# Altium schematic sheet IEA_uRobots_v2.SchDoc: IEA_uRobot v2 (part 1 of 2)
size 533 x 419 mm; Engineer: Paulo Loma Marconi
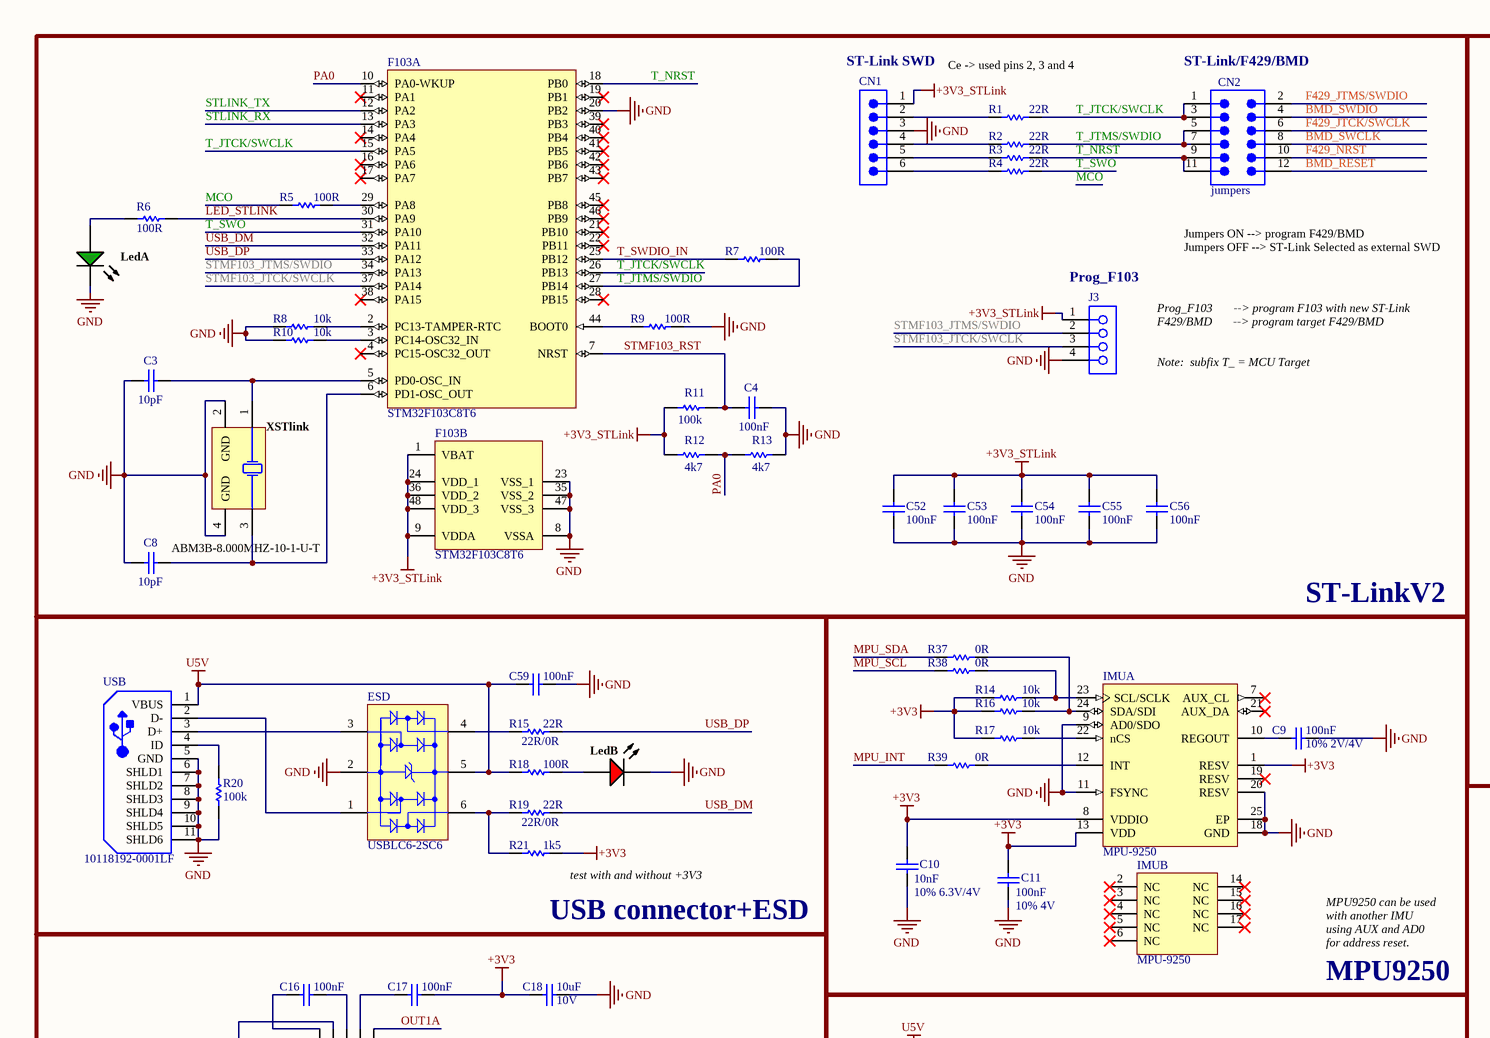
[diagram p0: IEA_uRobots_v2.SchDoc, top left]
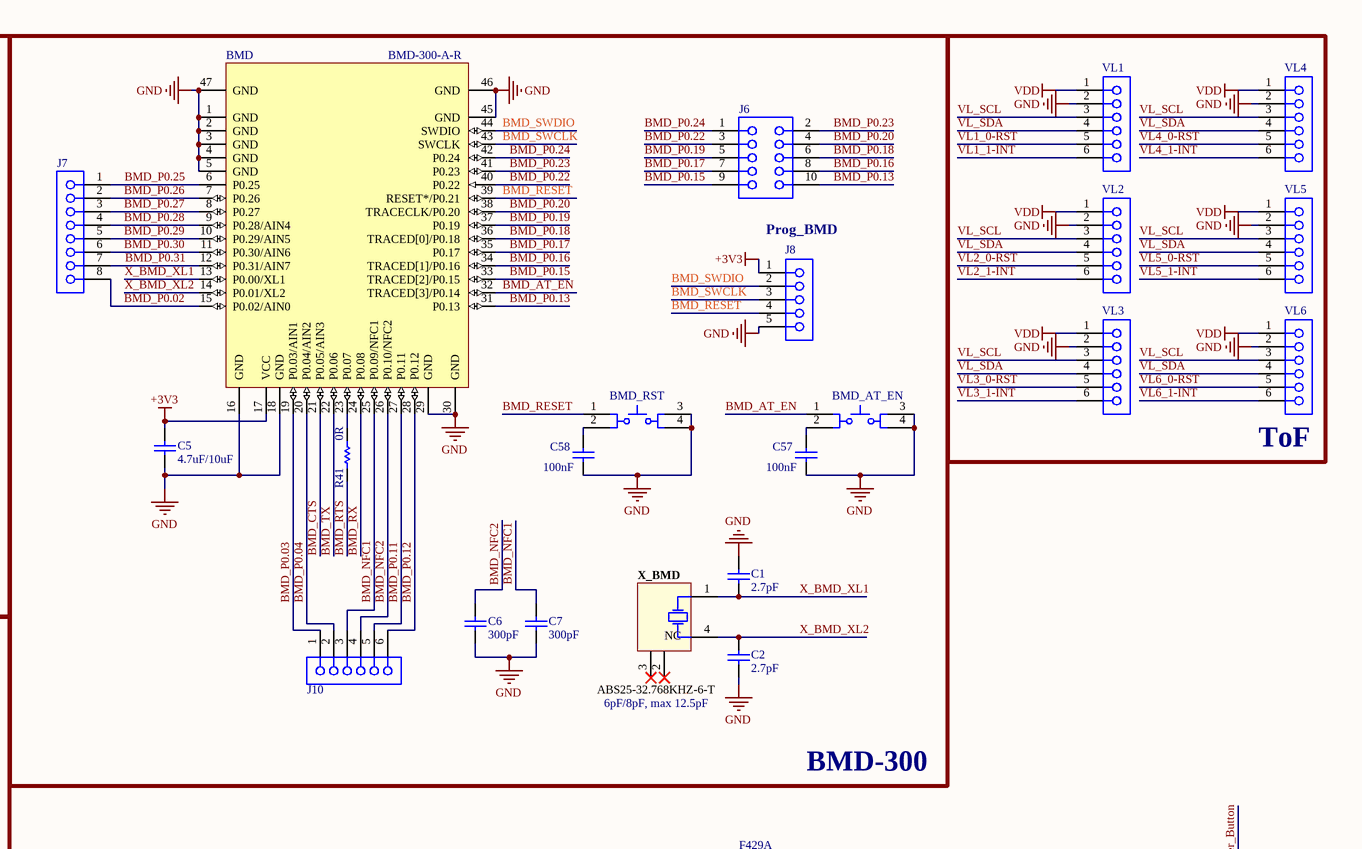
[diagram p1: IEA_uRobots_v2.SchDoc, top right]
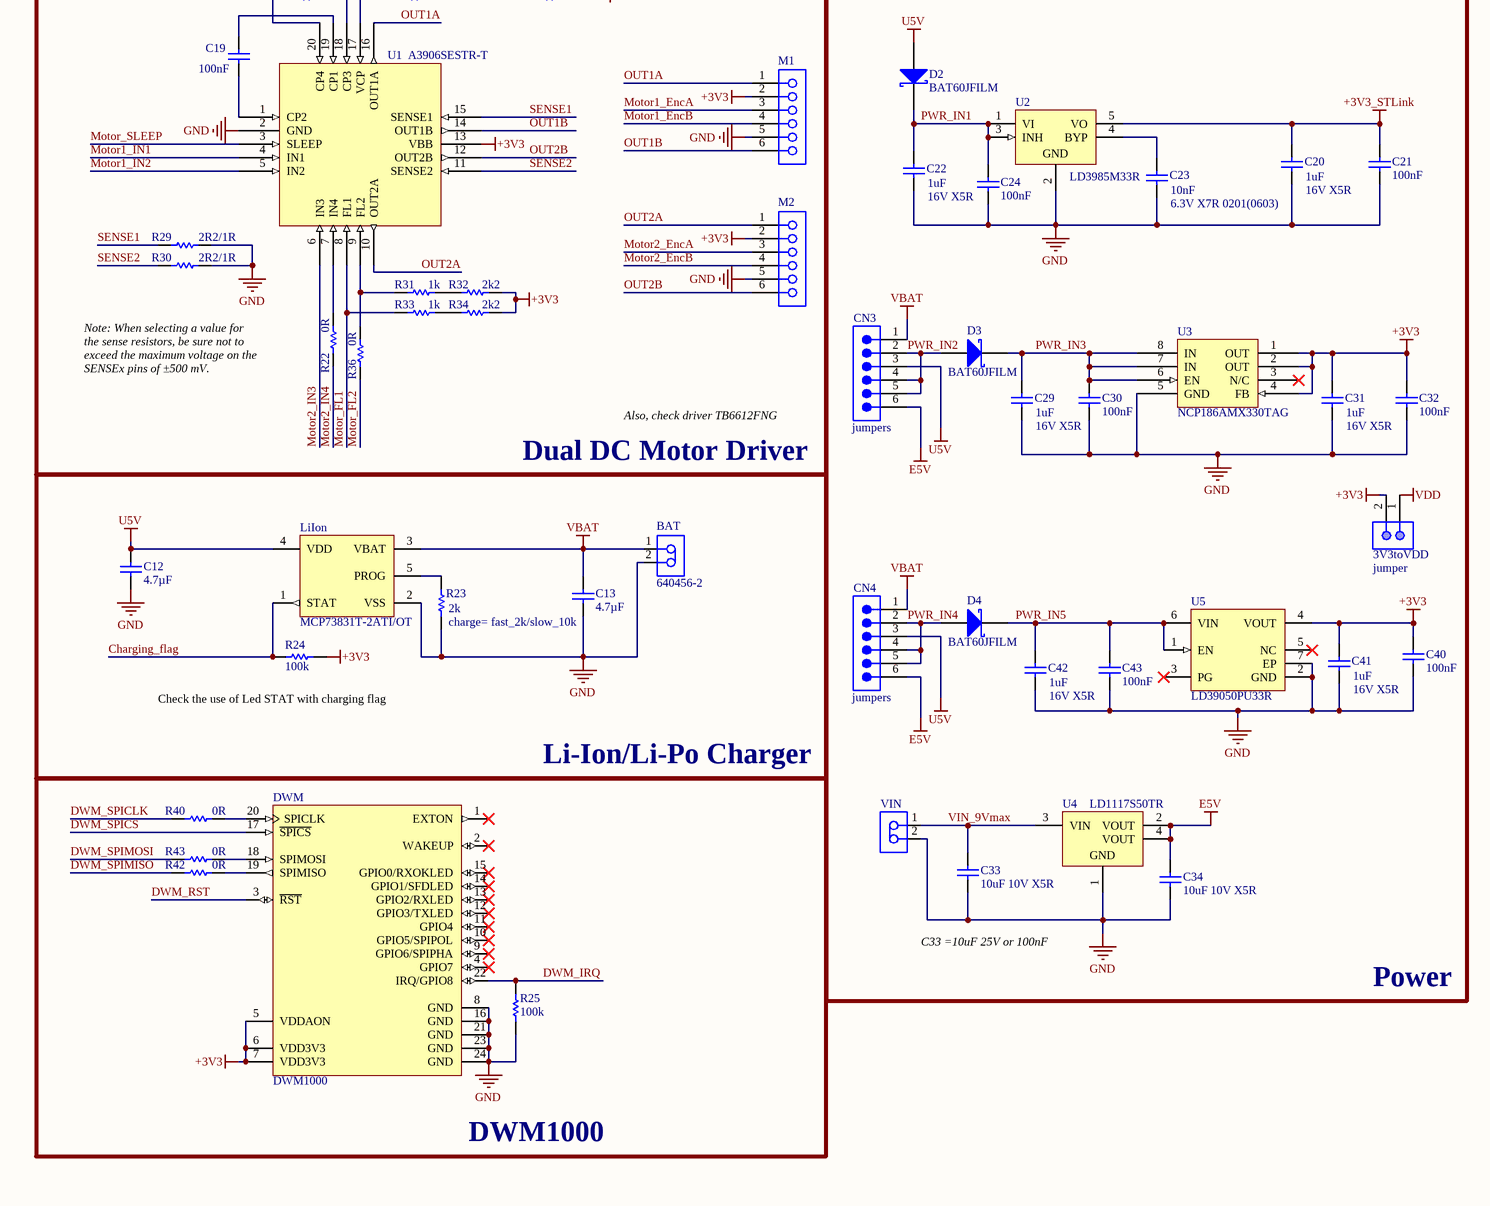
[diagram p2: IEA_uRobots_v2.SchDoc, bottom left]
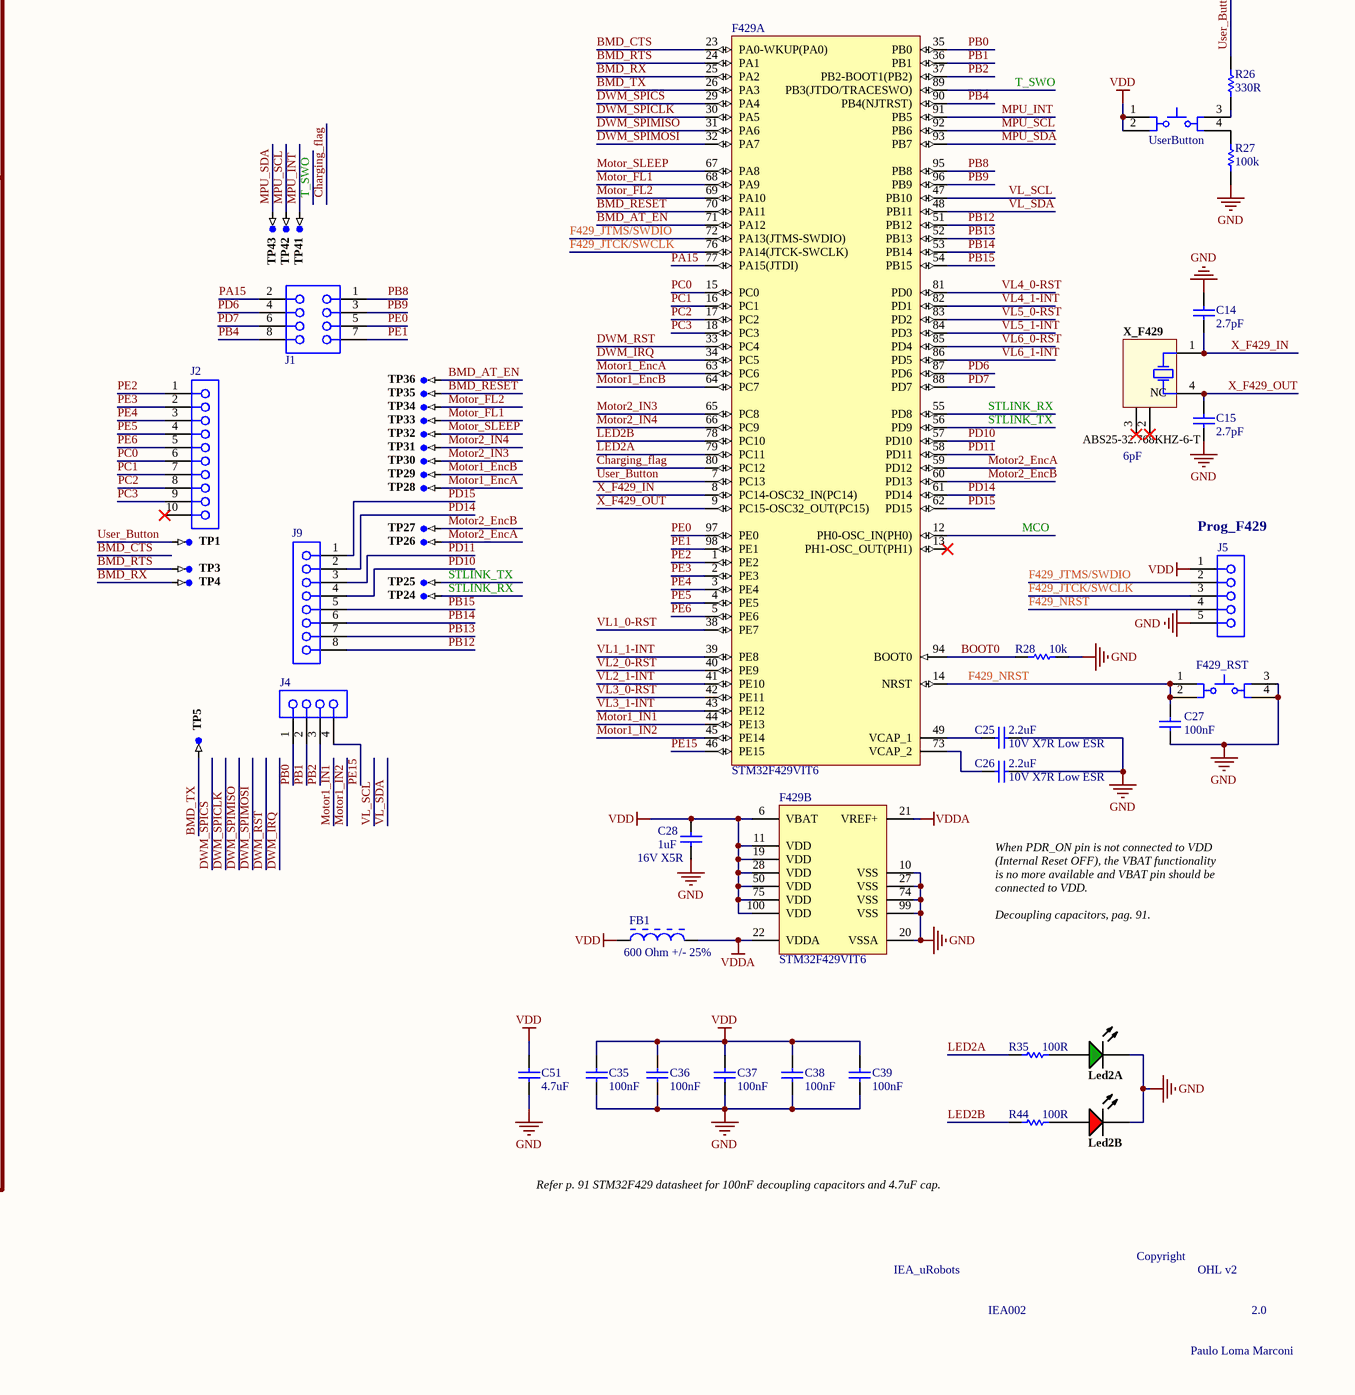
[diagram p3: IEA_uRobots_v2.SchDoc, bottom right]

## Parts
(Parts that share a designator on the sheet are numbered #1, #2 ... from top to bottom, then left to right.)
3V3toVDD  jumper  [WE-61300211121_V]
BAT  640456-2  [TECO-640456-2_V]
BMD  Manufacturer P/N: BMD-300-A-R  [BMD-300]  (hidden comment: BMD-300)
BMD_AT_EN  PTS645SM43SMTR92 LFS  [CKCP-PTS645S_V]  (value not drawn)
BMD_RST  PTS645SM43SMTR92 LFS  [CKCP-PTS645S_V]  (value not drawn)
C1  value 2.7pF  [CAPC0402(1005)60_N]  (hidden comment: CAP 2.7pF 16V 0402(1005))
C2  value 2.7pF  [CAPC0402(1005)60_N]  (hidden comment: CAP 2.7pF 16V 0402(1005))
C3  value 10pF  [CAPC0805(2012)100_L]  (hidden comment: CAP 10pF 16V 0805(2012))
C4  value 100nF  [CAPC0805(2012)100_M]  (hidden comment: CAP 100nF 50V 0805(2012))
C5  value 4.7uF/10uF  [CAPC2013X135X45ML10T25]  (hidden comment: GRM21BR61E475MA12L)
C6  value 300pF  [CAPC0805(2012)100_M]  (hidden comment: CAP 300pF 50V 0805(2012))
C7  value 300pF  [CAPC0805(2012)100_M]  (hidden comment: CAP 300pF 50V 0805(2012))
C8  value 10pF  [CAPC0805(2012)100_L]  (hidden comment: CAP 10pF 16V 0805(2012))
C9  10% 2V/4V  value 100nF  [CAPC0201(0603)33_M]
C10  10% 6.3V/4V  value 10nF  [CAPC0201(0603)33_L]
C11  10% 4V  value 100nF  [CAPC0201(0603)33_M]
C12  Capacitance: 4.7µF  [CAPC2013X145X20LL20]  (hidden comment: C2012X7R1E475K125AB)
C13  Capacitance: 4.7µF  [CAPC2013X145X20LL20]  (hidden comment: C2012X7R1E475K125AB)
C14  value 2.7pF  [CAPC0402(1005)60_N]  (hidden comment: CAP 2.7pF 16V 0402(1005))
C15  value 2.7pF  [CAPC0402(1005)60_N]  (hidden comment: CAP 2.7pF 16V 0402(1005))
C16  value 100nF  [CAPC0805(2012)100_M]  (hidden comment: CAP 100nF 50V 0805(2012))
C17  value 100nF  [CAPC0805(2012)100_M]  (hidden comment: CAP 100nF 50V 0805(2012))
C18  10V  Capacitance: 10uF  [CAPC2013X145X50LL20T20]
C19  value 100nF  [CAPC0805(2012)100_M]  (hidden comment: CAP 100nF 50V 0805(2012))
C20  16V X5R  value 1uF  [CAPC0805(2012)100_N]
C21  value 100nF  [CAPC0805(2012)100_M]  (hidden comment: CAP 100nF 50V 0805(2012))
C22  16V X5R  value 1uF  [CAPC0805(2012)100_N]
C23  6.3V X7R 0201(0603)  value 10nF  [CAPC0201(0603)33_L]
C24  value 100nF  [CAPC0805(2012)100_M]  (hidden comment: CAP 100nF 50V 0805(2012))
C25  10V X7R Low ESR  value 2.2uF  [CAPC0805(2012)145_N]
C26  10V X7R Low ESR  value 2.2uF  [CAPC0805(2012)145_N]
C27  value 100nF  [CAPC0805(2012)100_M]  (hidden comment: CAP 100nF 50V 0805(2012))
C28  16V X5R  value 1uF  [CAPC0805(2012)100_N]
C29  16V X5R  value 1uF  [CAPC0805(2012)100_N]
C30  value 100nF  [CAPC0805(2012)100_M]  (hidden comment: CAP 100nF 50V 0805(2012))
C31  16V X5R  value 1uF  [CAPC0805(2012)100_N]
C32  value 100nF  [CAPC0805(2012)100_M]  (hidden comment: CAP 100nF 50V 0805(2012))
C33  10uF 10V X5R  [CAPC2013X145X50LL20T20]
C34  10uF 10V X5R  [CAPC2013X145X50LL20T20]
C35  value 100nF  [CAPC0805(2012)100_M]  (hidden comment: CAP 100nF 50V 0805(2012))
C36  value 100nF  [CAPC0805(2012)100_M]  (hidden comment: CAP 100nF 50V 0805(2012))
C37  value 100nF  [CAPC0805(2012)100_M]  (hidden comment: CAP 100nF 50V 0805(2012))
C38  value 100nF  [CAPC0805(2012)100_M]  (hidden comment: CAP 100nF 50V 0805(2012))
C39  value 100nF  [CAPC0805(2012)100_M]  (hidden comment: CAP 100nF 50V 0805(2012))
C40  value 100nF  [CAPC0805(2012)100_M]  (hidden comment: CAP 100nF 50V 0805(2012))
C41  16V X5R  value 1uF  [CAPC0805(2012)100_N]
C42  16V X5R  value 1uF  [CAPC0805(2012)100_N]
C43  value 100nF  [CAPC0805(2012)100_M]  (hidden comment: CAP 100nF 50V 0805(2012))
C51  value 4.7uF  [CAPC2013X135X45ML10T25]  (hidden comment: GRM21BR61E475MA12L)
C52  value 100nF  [CAPC0805(2012)100_M]  (hidden comment: CAP 100nF 50V 0805(2012))
C53  value 100nF  [CAPC0805(2012)100_M]  (hidden comment: CAP 100nF 50V 0805(2012))
C54  value 100nF  [CAPC0805(2012)100_M]  (hidden comment: CAP 100nF 50V 0805(2012))
C55  value 100nF  [CAPC0805(2012)100_M]  (hidden comment: CAP 100nF 50V 0805(2012))
C56  value 100nF  [CAPC0805(2012)100_M]  (hidden comment: CAP 100nF 50V 0805(2012))
C57  value 100nF  [CAPC0805(2012)100_M]  (hidden comment: CAP 100nF 50V 0805(2012))
C58  value 100nF  [CAPC0805(2012)100_M]  (hidden comment: CAP 100nF 50V 0805(2012))
C59  value 100nF  [CAPC0805(2012)100_M]  (hidden comment: CAP 100nF 50V 0805(2012))
CN1  MTLW-106-05-X-S-210  [SMTC-MTLW-106-05-X-S-210]  (value not drawn)
CN2  jumpers  [SMTC-TSW-106-07-X-D]
CN3  jumpers  [SMTC-MTLW-106-05-X-S-210]
CN4  jumpers  [SMTC-MTLW-106-05-X-S-210]
D2  BAT60JFILM  [STM-SOD-323-2_V]
D3  BAT60JFILM  [STM-SOD-323-2_V]
D4  BAT60JFILM  [STM-SOD-323-2_V]
DWM  DWM1000  [DECW-DWM1000-24_V]
ESD  USBLC6-2SC6  [STM-SOT23-6L_V]
F103  STM32F103C8T6  [STM-LQFP48_L]  (parts A,B of 2)
F429  STM32F429VIT6  [STM-LQFP100_N]  (parts A,B of 2)
F429_RST  PTS645SM43SMTR92 LFS  [CKCP-PTS645S_V]  (value not drawn)
FB1  Impedance (at 100 MHz): 600 Ohm +/- 25%  [MURA-BLM21-H1-CHIP-2_V]  (hidden comment: BLM21AG601SN1D)
IMU#1  MPU-9250  [INSE-QFN-24-1700X1540TP_M]  (part A of 2)
IMU#2  MPU-9250  [INSE-QFN-24-1700X1540TP_M]  (part B of 2)
J1  SSW-104-02-T-D  [SMTC-SSW-104-02-X-D]  (value not drawn)
J2  SSW-110-01-G-S  [SMTC-SSW-110-01-G-S]  (value not drawn)
J3  SLW-104-01-G-S  [SMTC-SLW-104-01-X-S]  (value not drawn)
J4  SLW-104-01-G-S  [SMTC-SLW-104-01-X-S]  (value not drawn)
J5  SSW-105-01-G-S  [SMTC-SSW-105-01-X-S]  (value not drawn)
J6  BCS-105-F-D-TE  [SMTC-BCS-105-X-D-TE]  (value not drawn)
J7  SSW-108-01-G-S  [SMTC-SSW-108-01-G-S]  (value not drawn)
J8  SSW-105-01-G-S  [SMTC-SSW-105-01-X-S]  (value not drawn)
J9  SSQ-108-01-L-S  [SMTC-SSQ-108-01-X-S]  (value not drawn)
J10  SSW-106-02-G-S  [SMTC-SSW-106-02-X-S]  (value not drawn)
Led  HSMF-C155  [AVAG-HSMF-C15X_V]  (value not drawn)  (parts A,B of 2)
Led2  HSMF-C155  [AVAG-HSMF-C15X_V]  (value not drawn)  (parts A,B of 2)
LiIon  MCP73831T-2ATI/OT  [SOT-23-OT5_M]
M1  SSW-106-02-G-S  [SMTC-SSW-106-02-X-S]  (value not drawn)
M2  SSW-106-02-G-S  [SMTC-SSW-106-02-X-S]  (value not drawn)
R1  value 22R  [RESC0805(2012)_L]  (hidden comment: 22R 1% 0805(2012))
R2  value 22R  [RESC0805(2012)_L]  (hidden comment: 22R 1% 0805(2012))
R3  value 22R  [RESC0805(2012)_L]  (hidden comment: 22R 1% 0805(2012))
R4  value 22R  [RESC0805(2012)_L]  (hidden comment: 22R 1% 0805(2012))
R5  value 100R  [RESC0805(2012)_L]  (hidden comment: 100R 1% 0805(2012))
R6  value 100R  [RESC0805(2012)_L]  (hidden comment: 100R 1% 0805(2012))
R7  value 100R  [RESC0805(2012)_L]  (hidden comment: 100R 1% 0805(2012))
R8  value 10k  [RESC0805(2012)_M]  (hidden comment: 10K 1% 0805(2012))
R9  value 100R  [RESC0805(2012)_L]  (hidden comment: 100R 1% 0805(2012))
R10  value 10k  [RESC0805(2012)_M]  (hidden comment: 10K 1% 0805(2012))
R11  value 100k  [RESC0805(2012)_L]  (hidden comment: 100K 1% 0805(2012))
R12  value 4k7  [RESC0805(2012)_M]  (hidden comment: 4K7 1% 0805(2012))
R13  value 4k7  [RESC0805(2012)_M]  (hidden comment: 4K7 1% 0805(2012))
R14  value 10k  [RESC0805(2012)_M]  (hidden comment: 10K 1% 0805(2012))
R15  22R/0R  value 22R  [RESC0805(2012)_L]
R16  value 10k  [RESC0805(2012)_M]  (hidden comment: 10K 1% 0805(2012))
R17  value 10k  [RESC0805(2012)_M]  (hidden comment: 10K 1% 0805(2012))
R18  value 100R  [RESC0805(2012)_L]  (hidden comment: 100R 1% 0805(2012))
R19  22R/0R  value 22R  [RESC0805(2012)_L]
R20  value 100k  [RESC0805(2012)_L]  (hidden comment: 100K 1% 0805(2012))
R21  value 1k5  [RESC0805(2012)_M]  (hidden comment: 1K5 1% 0805(2012))
R22  0R  [RESC0805(2012)_N]
R23  charge= fast_2k/slow_10k  value 2k  [RESC0805(2012)_L]
R24  value 100k  [RESC0805(2012)_L]  (hidden comment: 100K 1% 0805(2012))
R25  value 100k  [RESC0805(2012)_L]  (hidden comment: 100K 1% 0805(2012))
R26  value 330R  [RESC0805(2012)_M]  (hidden comment: 330R 1% 0805(2012))
R27  value 100k  [RESC0805(2012)_L]  (hidden comment: 100K 1% 0805(2012))
R28  value 10k  [RESC0805(2012)_M]  (hidden comment: 10K 1% 0805(2012))
R29  value 2R2/1R  [RESC0805(2012)_M]  (hidden comment: 1R 1% 0805(2012))
R30  value 2R2/1R  [RESC0805(2012)_M]  (hidden comment: 1R 1% 0805(2012))
R31  value 1k  [RESC0805(2012)_M]  (hidden comment: 1K 1% 0805(2012))
R32  value 2k2  [RESC0805(2012)_N]  (hidden comment: 2K2 1% 0805(2012))
R33  value 1k  [RESC0805(2012)_M]  (hidden comment: 1K 1% 0805(2012))
R34  value 2k2  [RESC0805(2012)_N]  (hidden comment: 2K2 1% 0805(2012))
R35  value 100R  [RESC0805(2012)_L]  (hidden comment: 100R 1% 0805(2012))
R36  0R  [RESC0805(2012)_N]
R37  0R  [RESC0805(2012)_N]
R38  0R  [RESC0805(2012)_N]
R39  0R  [RESC0805(2012)_N]
R40  0R  [RESC0805(2012)_N]
R41  0R  [RESC0805(2012)_N]
R42  0R  [RESC0805(2012)_N]
R43  0R  [RESC0805(2012)_N]
R44  value 100R  [RESC0805(2012)_L]  (hidden comment: 100R 1% 0805(2012))
TP1  TP-SM-C-100  [TP-SM-C-100]  (value not drawn)  (no BOM)
TP3  TP-SM-C-100  [TP-SM-C-100]  (value not drawn)  (no BOM)
TP4  TP-SM-C-100  [TP-SM-C-100]  (value not drawn)  (no BOM)
TP5  TP-SM-C-100  [TP-SM-C-100]  (value not drawn)  (no BOM)
TP24  TP-SM-C-100  [TP-SM-C-100]  (value not drawn)  (no BOM)
TP25  TP-SM-C-100  [TP-SM-C-100]  (value not drawn)  (no BOM)
TP26  TP-SM-C-100  [TP-SM-C-100]  (value not drawn)  (no BOM)
TP27  TP-SM-C-100  [TP-SM-C-100]  (value not drawn)  (no BOM)
TP28  TP-SM-C-100  [TP-SM-C-100]  (value not drawn)  (no BOM)
TP29  TP-SM-C-100  [TP-SM-C-100]  (value not drawn)  (no BOM)
TP30  TP-SM-C-100  [TP-SM-C-100]  (value not drawn)  (no BOM)
TP31  TP-SM-C-100  [TP-SM-C-100]  (value not drawn)  (no BOM)
TP32  TP-SM-C-100  [TP-SM-C-100]  (value not drawn)  (no BOM)
TP33  TP-SM-C-100  [TP-SM-C-100]  (value not drawn)  (no BOM)
TP34  TP-SM-C-100  [TP-SM-C-100]  (value not drawn)  (no BOM)
TP35  TP-SM-C-100  [TP-SM-C-100]  (value not drawn)  (no BOM)
TP36  TP-SM-C-100  [TP-SM-C-100]  (value not drawn)  (no BOM)
TP41  TP-SM-C-100  [TP-SM-C-100]  (value not drawn)  (no BOM)
TP42  TP-SM-C-100  [TP-SM-C-100]  (value not drawn)  (no BOM)
TP43  TP-SM-C-100  [TP-SM-C-100]  (value not drawn)  (no BOM)
U1  A3906SESTR-T  [A3906SESTR-T]
U2  LD3985M33R  [SOT23-5L_N]
U3  NCP186AMX330TAG  [NCP186AMX330TAG]
U4  LD1117S50TR  [SOT-223_L]
U5  LD39050PU33R  [DFN6D_L]
USB  10118192-0001LF  [FCI-10118192-0001LF-5_V]
UserButton  PTS645SM43SMTR92 LFS  [CKCP-PTS645S_V]  (value not drawn)
VIN  640456-2  [TECO-640456-2_V]  (value not drawn)
VL1  SSW-106-02-G-S  [SMTC-SSW-106-02-X-S]  (value not drawn)
VL2  SSW-106-02-G-S  [SMTC-SSW-106-02-X-S]  (value not drawn)
VL3  SSW-106-02-G-S  [SMTC-SSW-106-02-X-S]  (value not drawn)
VL4  SSW-106-02-G-S  [SMTC-SSW-106-02-X-S]  (value not drawn)
VL5  SSW-106-02-G-S  [SMTC-SSW-106-02-X-S]  (value not drawn)
VL6  SSW-106-02-G-S  [SMTC-SSW-106-02-X-S]  (value not drawn)
X_BMD  ABS25-32.768KHZ-6-T  Load Capacitance: 6pF/8pF, max 12.5pF  [ABRA-ABS25-4_V]
X_F429  ABS25-32.768KHZ-6-T  Load Capacitance: 6pF  [ABRA-ABS25-4_V]
XSTlink  ABM3B-8.000MHZ-10-1-U-T  [ABRA-ABM3B_V]

## Blocks framed on the sheet
ST-LinkV2: C3 C4 C8 C52-C56 CN1 CN2 F103 J3 Led R1-R13 XSTlink
BMD-300: BMD BMD_AT_EN BMD_RST C1 C2 C5-C7 C57 C58 J6-J8 J10 R41 X_BMD
ToF: VL1-VL6
USB connector+ESD: C59 ESD Led R15 R18-R21 USB
Dual DC Motor Driver: C16-C19 M1 M2 R22 R29-R34 R36 U1

## Nets
+3V3: 3V3toVDD.2 BMD.17(VCC) C5.1 C10.2 C11.2 C17.2 C18.1 C31.2 C32.2 C40.2 C41.2 DWM.5(VDDAON) DWM.6(VDD3V3) DWM.7(VDD3V3) IMU#1.1(RESV) IMU#1.8(VDDIO) IMU#1.13(VDD) J8.1 M1.2 M2.2 R14.1 R16.1 R17.1 R21.2 R24.1 R32.2 R34.2 U1.13(VBB) U3.1(OUT) U3.2(OUT) U3.4(FB) U5.4(VOUT)
+3V3_STLink: C20.2 C21.2 C52.1 C53.1 C54.1 C55.1 C56.1 CN1.1 F103.1(VBAT) F103.9(VDDA) F103.24(VDD_1) F103.36(VDD_2) F103.48(VDD_3) J3.1 R11.1 R12.1 U2.5(VO)
E5V: C34.2 CN3.6 CN4.6 U4.2(VOUT) U4.4(VOUT)
GND: BAT.2 BMD.1(GND) BMD.2(GND) BMD.3(GND) BMD.4(GND) BMD.5(GND) BMD.16(GND) BMD.18(GND) BMD.29(GND) BMD.30(GND) BMD.45(GND) BMD.46(GND) BMD.47(GND) BMD_AT_EN.3 BMD_AT_EN.4 BMD_RST.3 BMD_RST.4 C1.2 C2.1 C3.1 C4.2 C5.2 C6.1 C7.1 C8.1 C9.1 C10.1 C11.1 C12.1 C13.1 C14.2 C15.1 C18.2 C20.1 C21.1 C22.1 C23.1 C24.1 C25.2 C26.2 C27.2 C28.1 C29.1 C30.1 C31.1 C32.1 C33.1 C34.1 C35.2 C36.2 C37.2 C38.2 C39.2 C40.1 C41.1 C42.1 C43.1 C51.2 C52.2 C53.2 C54.2 C55.2 C56.2 C57.2 C58.2 C59.1 CN1.3 DWM.8(GND) DWM.16(GND) DWM.21(GND) DWM.23(GND) DWM.24(GND) ESD.2(GND) F103.8(VSSA) F103.20(PB2) F103.23(VSS_1) F103.35(VSS_2) F103.47(VSS_3) F429.10(VSS) F429.20(VSSA) F429.27(VSS) F429.74(VSS) F429.99(VSS) F429_RST.3 F429_RST.4 IMU#1.9(AD0/SDO) IMU#1.11(FSYNC) IMU#1.18(GND) IMU#1.20(RESV) IMU#1.25(EP) J3.4 J5.5 J8.5 Led.2(K1) Led.4(K2) Led2.2(K1) Led2.4(K2) LiIon.2(VSS) M1.5 M2.5 R8.1 R9.2 R10.1 R13.2 R20.1 R23.1 R25.1 R27.1 R28.1 R29.2 R30.2 U1.2(GND) U2.2(GND) U3.5(GND) U4.1(GND) U5.2(GND) U5.7(EP) USB.5(GND) USB.6(SHLD1) USB.7(SHLD2) USB.8(SHLD3) USB.9(SHLD4) USB.10(SHLD5) USB.11(SHLD6) VIN.2 VL1.2 VL2.2 VL3.2 VL4.2 VL5.2 VL6.2 XSTlink.2(GND) XSTlink.4(GND)
U5V: C12.2 C59.2 CN3.3 CN4.3 D2.1(A) ESD.5(VBUS) LiIon.4(VDD) R18.1 USB.1(VBUS)
VBAT: BAT.1 C13.2 CN3.1 CN4.1 LiIon.3(VBAT)
VDD: 3V3toVDD.1 C28.2 C35.1 C36.1 C37.1 C38.1 C39.1 C51.1 F429.6(VBAT) F429.11(VDD) F429.19(VDD) F429.28(VDD) F429.50(VDD) F429.75(VDD) F429.100(VDD) FB1.1 J5.1 UserButton.1 UserButton.2 VL1.1 VL2.1 VL3.1 VL4.1 VL5.1 VL6.1
VDDA: F429.21(VREF+) F429.22(VDDA) FB1.2
BMD_AT_EN: BMD.32(TRACED[3]/P0.14) BMD_AT_EN.1 F429.71(PA12) TP36.1
BMD_CTS: BMD.21(P0.05/AIN3) F429.23(PA0-WKUP(PA0))
BMD_NFC1: BMD.25(P0.09/NFC1) C7.2 J10.3
BMD_NFC2: BMD.26(P0.10/NFC2) C6.2 J10.4
BMD_P0.02: BMD.15(P0.02/AIN0) J7.8
BMD_P0.03: BMD.19(P0.03/AIN1) J10.1
BMD_P0.04: BMD.20(P0.04/AIN2) J10.2
BMD_P0.11: BMD.27(P0.11) J10.5
BMD_P0.12: BMD.28(P0.12) J10.6
BMD_P0.13: BMD.31(P0.13) J6.10
BMD_P0.15: BMD.33(TRACED[2]/P0.15) J6.9
BMD_P0.16: BMD.34(TRACED[1]/P0.16) J6.8
BMD_P0.17: BMD.35(P0.17) J6.7
BMD_P0.18: BMD.36(TRACED[0]/P0.18) J6.6
BMD_P0.19: BMD.37(P0.19) J6.5
BMD_P0.20: BMD.38(TRACECLK/P0.20) J6.4
BMD_P0.22: BMD.40(P0.22) J6.3
BMD_P0.23: BMD.41(P0.23) J6.2
BMD_P0.24: BMD.42(P0.24) J6.1
BMD_P0.25: BMD.6(P0.25) J7.1
BMD_P0.26: BMD.7(P0.26) J7.2
BMD_P0.27: BMD.8(P0.27) J7.3
BMD_P0.28: BMD.9(P0.28/AIN4) J7.4
BMD_P0.29: BMD.10(P0.29/AIN5) J7.5
BMD_P0.30: BMD.11(P0.30/AIN6) J7.6
BMD_P0.31: BMD.12(P0.31/AIN7) J7.7
BMD_RESET: BMD.39(RESET*/P0.21) BMD_RST.1 CN2.12 F429.70(PA11) J8.4 TP35.1
BMD_RTS: F429.24(PA1) R41.1 TP3.1
BMD_RX: BMD.24(P0.08) F429.25(PA2) TP4.1
BMD_SWCLK: BMD.43(SWCLK) CN2.8 J8.3
BMD_SWDIO: BMD.44(SWDIO) CN2.4 J8.2
BMD_TX: BMD.22(P0.06) F429.26(PA3) TP5.1
BOOT0: F429.94(BOOT0) R28.2
Charging_flag: F429.80(PC12) LiIon.1(STAT) R24.2
DWM_IRQ: DWM.22(IRQ/GPIO8) F429.34(PC5) R25.2
DWM_RST: DWM.3(~{RST}) F429.33(PC4)
DWM_SPICLK: F429.30(PA5) R40.1
DWM_SPICS: DWM.17(~{SPICS}) F429.29(PA4)
DWM_SPIMISO: F429.31(PA6) R42.1
DWM_SPIMOSI: F429.32(PA7) R43.1
F429_JTCK/SWCLK: CN2.6 F429.76(PA14(JTCK-SWCLK)) J5.3
F429_JTMS/SWDIO: CN2.2 F429.72(PA13(JTMS-SWDIO)) J5.2
F429_NRST: C27.1 CN2.10 F429.14(NRST) F429_RST.1 F429_RST.2 J5.4
LED2A: F429.79(PC11) R35.2
LED2B: F429.78(PC10) R44.2
LED_STLINK: F103.30(PA9) R6.1
MCO: F429.12(PH0-OSC_IN(PH0)) R5.1
Motor1_EncA: F429.63(PC6) M1.3 TP28.1
Motor1_EncB: F429.64(PC7) M1.4 TP29.1
Motor1_IN1: F429.44(PE13) U1.4(IN1)
Motor1_IN2: F429.45(PE14) U1.5(IN2)
Motor2_EncA: F429.59(PD12) M2.3 TP26.1
Motor2_EncB: F429.60(PD13) M2.4 TP27.1
Motor2_IN3: F429.65(PC8) TP30.1 U1.6(IN3)
Motor2_IN4: F429.66(PC9) R22.2 TP31.1
Motor_FL1: F429.68(PA9) R33.1 TP33.1 U1.8(FL1)
Motor_FL2: F429.69(PA10) R36.2 TP34.1
Motor_SLEEP: F429.67(PA8) TP32.1 U1.3(SLEEP)
MPU_INT: F429.91(PB5) R39.1 TP41.1
MPU_SCL: F429.92(PB6) R38.1 TP42.1
MPU_SDA: F429.93(PB7) R37.1 TP43.1
OUT1A: M1.1 U1.16(OUT1A)
OUT1B: M1.6 U1.14(OUT1B)
OUT2A: M2.1 U1.10(OUT2A)
OUT2B: M2.6 U1.12(OUT2B)
PA0: F103.10(PA0-WKUP) R12.2 R13.1
PA15: F429.77(PA15(JTDI)) J1.2
PB0: F429.35(PB0) J4.1
PB1: F429.36(PB1) J4.2
PB2: F429.37(PB2-BOOT1(PB2)) J4.3
PB4: F429.90(PB4(NJTRST)) J1.8
PB8: F429.95(PB8) J1.1
PB9: F429.96(PB9) J1.3
PB12: F429.51(PB12) J9.8
PB13: F429.52(PB13) J9.7
PB14: F429.53(PB14) J9.6
PB15: F429.54(PB15) J9.5
PC0: F429.15(PC0) J2.6
PC1: F429.16(PC1) J2.7
PC2: F429.17(PC2) J2.8
PC3: F429.18(PC3) J2.9
PD6: F429.87(PD6) J1.4
PD7: F429.88(PD7) J1.6
PD10: F429.57(PD10) J9.4
PD11: F429.58(PD11) J9.3
PD14: F429.61(PD14) J9.2
PD15: F429.62(PD15) J9.1
PE0: F429.97(PE0) J1.5
PE1: F429.98(PE1) J1.7
PE2: F429.1(PE2) J2.1
PE3: F429.2(PE3) J2.2
PE4: F429.3(PE4) J2.3
PE5: F429.4(PE5) J2.4
PE6: F429.5(PE6) J2.5
PE15: F429.46(PE15) J4.4
PWR_IN1: C22.2 C24.2 D2.2(K) U2.1(VI) U2.3(INH)
PWR_IN2: CN3.2 CN3.4 CN3.5 D3.1(A)
PWR_IN3: C29.2 C30.2 D3.2(K) U3.6(EN) U3.7(IN) U3.8(IN)
PWR_IN4: CN4.2 CN4.4 CN4.5 D4.1(A)
PWR_IN5: C42.2 C43.2 D4.2(K) U5.1(EN) U5.6(VIN)
SENSE1: R29.1 U1.15(SENSE1)
SENSE2: R30.1 U1.11(SENSE2)
STLINK_RX: F103.13(PA3) F429.55(PD8) TP24.1
STLINK_TX: F103.12(PA2) F429.56(PD9) TP25.1
STMF103_JTCK/SWCLK: F103.37(PA14) J3.3
STMF103_JTMS/SWDIO: F103.34(PA13) J3.2
STMF103_RST: C4.1 F103.7(NRST) R11.2
T_JTCK/SWCLK: CN2.1 CN2.3 F103.15(PA5) F103.26(PB13) R1.2
T_JTMS/SWDIO: CN2.5 CN2.7 F103.27(PB14) R2.2 R7.2
T_NRST: CN2.9 CN2.11 F103.18(PB0) R3.2
T_SWDIO_IN: F103.25(PB12) R7.1
T_SWO: F103.31(PA10) F429.89(PB3(JTDO/TRACESWO)) R4.2
USB_DM: F103.32(PA11) R19.2
USB_DP: F103.33(PA12) R15.2
User_Button: F429.7(PC13) R26.2 TP1.1
VIN_9Vmax: C33.2 U4.3(VIN) VIN.1
VL1_0-RST: F429.38(PE7) VL1.5
VL1_1-INT: F429.39(PE8) VL1.6
VL2_0-RST: F429.40(PE9) VL2.5
VL2_1-INT: F429.41(PE10) VL2.6
VL3_0-RST: F429.42(PE11) VL3.5
VL3_1-INT: F429.43(PE12) VL3.6
VL4_0-RST: F429.81(PD0) VL4.5
VL4_1-INT: F429.82(PD1) VL4.6
VL5_0-RST: F429.83(PD2) VL5.5
VL5_1-INT: F429.84(PD3) VL5.6
VL6_0-RST: F429.85(PD4) VL6.5
VL6_1-INT: F429.86(PD5) VL6.6
VL_SCL: F429.47(PB10) VL1.3 VL2.3 VL3.3 VL4.3 VL5.3 VL6.3
VL_SDA: F429.48(PB11) VL1.4 VL2.4 VL3.4 VL4.4 VL5.4 VL6.4
X_BMD_XL1: BMD.13(P0.00/XL1) C1.1 X_BMD.1(X1)
X_BMD_XL2: BMD.14(P0.01/XL2) C2.2 X_BMD.4(X2)
X_F429_IN: C14.1 F429.8(PC14-OSC32_IN(PC14)) X_F429.1(X1)
X_F429_OUT: C15.2 F429.9(PC15-OSC32_OUT(PC15)) X_F429.4(X2)
NetBMD_23: BMD.23(P0.07) R41.2
NetBMD_AT_EN_2: BMD_AT_EN.2 C57.1
NetBMD_RST_2: BMD_RST.2 C58.1
NetC3_2: C3.2 F103.5(PD0-OSC_IN) XSTlink.1(X1)
NetC8_2: C8.2 F103.6(PD1-OSC_OUT) XSTlink.3(X2)
NetC9_2: C9.2 IMU#1.10(REGOUT)
NetC16_1: C16.1 U1.20(CP4)
NetC16_2: C16.2 U1.18(CP3)
NetC17_1: C17.1 U1.17(VCP)
NetC19_1: C19.1 U1.1(CP2)
NetC19_2: C19.2 U1.19(CP1)
NetC23_2: C23.2 U2.4(BYP)
NetC25_1: C25.1 F429.49(VCAP_1)
NetC26_1: C26.1 F429.73(VCAP_2)
NetCN1_2: CN1.2 R1.1
NetCN1_4: CN1.4 R2.1
NetCN1_5: CN1.5 R3.1
NetCN1_6: CN1.6 R4.1
NetDWM_18: DWM.18(SPIMOSI) R43.2
NetDWM_19: DWM.19(SPIMISO) R42.2
NetDWM_20: DWM.20(SPICLK) R40.2
NetESD_1: ESD.1(I/O_1) USB.2(D-)
NetESD_3: ESD.3(I/O_2) USB.3(D+)
NetESD_4: ESD.4(I/O_3) R15.1
NetESD_6: ESD.6(I/O_4) R19.1 R21.1
NetF103_2: F103.2(PC13-TAMPER-RTC) R8.2
NetF103_3: F103.3(PC14-OSC32_IN) R10.2
NetF103_29: F103.29(PA8) R5.2
NetF103_44: F103.44(BOOT0) R9.1
NetIMU#1_12: IMU#1.12(INT) R39.2
NetIMU#1_22: IMU#1.22(nCS) R17.2
NetIMU#1_23: IMU#1.23(SCL/SCLK) R14.2 R38.2
NetIMU#1_24: IMU#1.24(SDA/SDI) R16.2 R37.2
NetLed2_1: Led2.1(A1) R35.1
NetLed2_3: Led2.3(A2) R44.1
NetLed_1: Led.1(A1) R6.2
NetLed_3: Led.3(A2) R18.2
NetLiIon_5: LiIon.5(PROG) R23.2
NetR20_2: R20.2 USB.4(ID)
NetR22_1: R22.1 U1.7(IN4)
NetR26_1: R26.1 UserButton.3
NetR27_2: R27.2 UserButton.4
NetR31_1: R31.1 R36.1 U1.9(FL2)
NetR31_2: R31.2 R32.1
NetR33_2: R33.2 R34.1

Not connected (* = marked no-connect by the designer): DWM 1(EXTON)* 2(WAKEUP)* 4(GPIO7)* 9(GPIO6/SPIPHA)* 10(GPIO5/SPIPOL)* 11(GPIO4)* 12(GPIO3/TXLED)* 13(GPIO2/RXLED)* 14(GPIO1/SFDLED)* 15(GPIO0/RXOKLED)*; F103 4(PC15-OSC32_OUT)* 11(PA1)* 14(PA4)* 16(PA6)* 17(PA7)* 19(PB1)* 21(PB10)* 22(PB11)* 28(PB15)* 38(PA15)* 39(PB3)* 40(PB4)* 41(PB5)* 42(PB6)* 43(PB7)* 45(PB8)* 46(PB9)*; F429 13(PH1-OSC_OUT(PH1))*; IMU#1 7(AUX_CL)* 19(RESV)* 21(AUX_DA)*; IMU#2 2(NC)* 3(NC)* 4(NC)* 5(NC)* 6(NC)* 14(NC)* 15(NC)* 16(NC)* 17(NC)*; J2 10*; U3 3(N/C)*; U5 3(PG)* 5(NC)*; X_BMD 2(NC)* 3(NC)*; X_F429 2(NC)* 3(NC)*

## Notes on the sheet
- (near CN1) ST-Link SWD
- (near R1) Ce -> used pins 2, 3 and 4
- (near CN2) ST-Link/F429/BMD
- Jumpers ON --> program F429/BMD
  Jumpers OFF --> ST-Link Selected as external SWD
- Prog_BMD
- (near J3) Prog_F103
- Prog_F103       --> program F103 with new ST-Link
  F429/BMD       --> program target F429/BMD
  Note:  subfix T_ = MCU Target
- (near R21) test with and without +3V3
- MPU9250 can be used with another IMU using AUX and AD0 for address reset.
- MPU9250
- (near J5) Prog_F429
- Note: When selecting a value for the sense resistors, be sure not to
  exceed the maximum voltage on the SENSEx pins of ±500 mV.
- Also, check driver TB6612FNG
- (near R24) Check the use of Led STAT with charging flag
- When PDR_ON pin is not connected to VDD (Internal Reset OFF), the VBAT functionality is no more available and VBAT pin should be connected to VDD.
  Decoupling capacitors, pag. 91.
- Li-Ion/Li-Po Charger
- C33 =10uF 25V or 100nF
- Power
- Refer p. 91 STM32F429 datasheet for 100nF decoupling capacitors and 4.7uF cap.
- IEA_uRobots
- Copyright
- OHL v2
- DWM1000
- IEA002
- 2.0
- Paulo Loma Marconi